# EAGLE design Lattice FPGA standard feather wing (EAGLE 9.5.2)
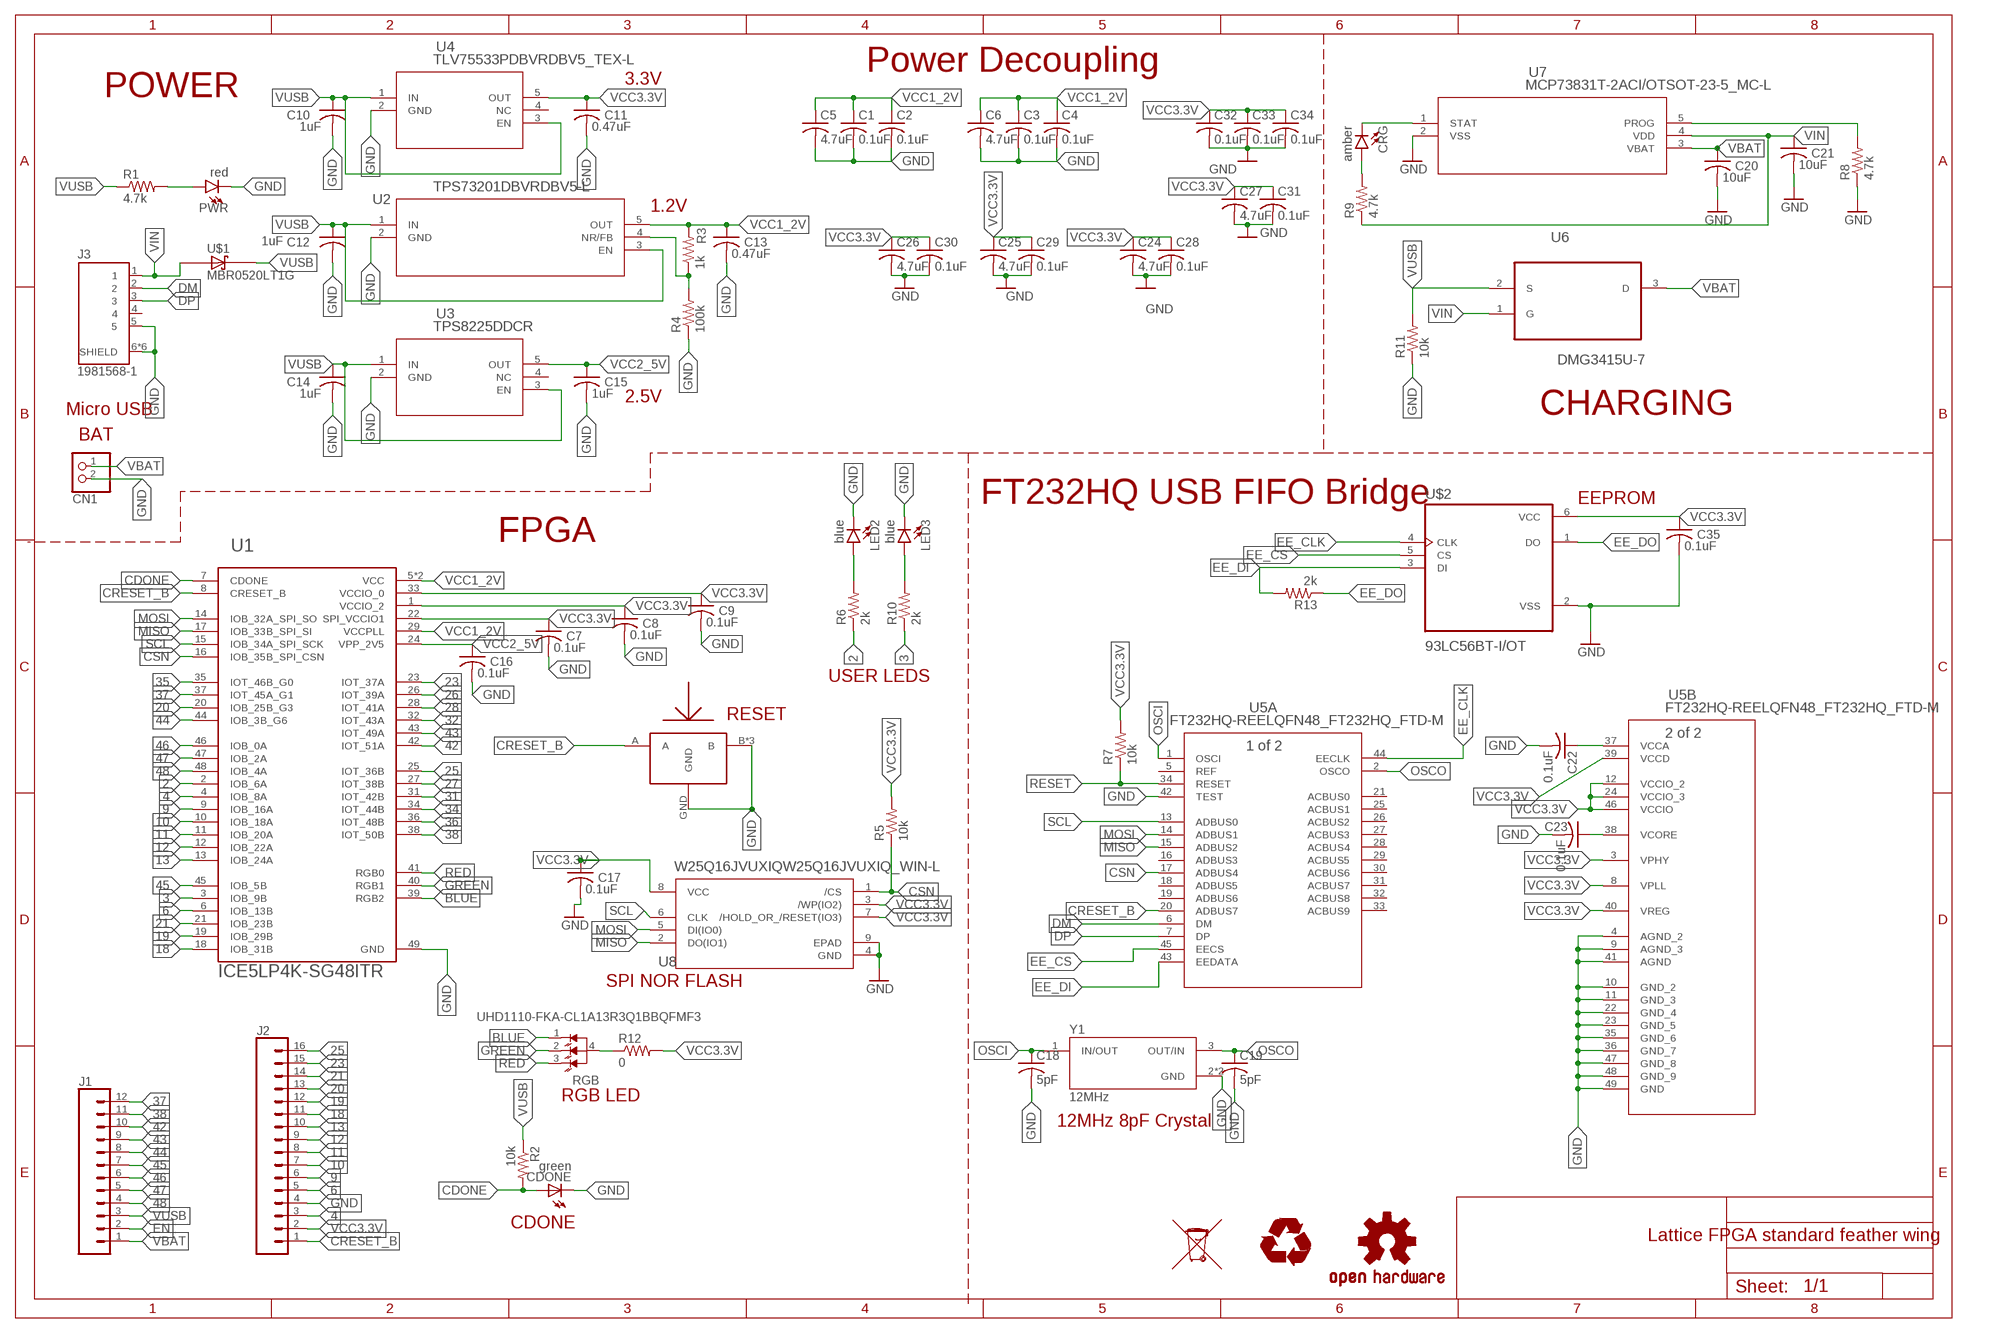
[diagram p0: schematic, sheet 1]

## Parts
C1  0.1uF  C-USC0402  [C0402]
C2  0.1uF  C-USC0402  [C0402]
C3  0.1uF  C-USC0402  [C0402]
C4  0.1uF  C-USC0402  [C0402]
C5  4.7uF  C-USC0603  [C0603]
C6  4.7uF  C-USC0603  [C0603]
C7  0.1uF  C-USC0402  [C0402]
C8  0.1uF  C-USC0402  [C0402]
C9  0.1uF  C-USC0402  [C0402]
C10  1uF  C-USC0402  [C0402]
C11  0.47uF  C-USC0402  [C0402]
C12  1uF  C-USC0402  [C0402]
C13  0.47uF  C-USC0402  [C0402]
C14  1uF  C-USC0402  [C0402]
C15  1uF  C-USC0402  [C0402]
C16  0.1uF  C-USC0402  [C0402]
C17  0.1uF  C-USC0402  [C0402]
C18  5pF  C-USC0402  [C0402]
C19  5pF  C-USC0402  [C0402]
C20  10uF  C-USC0603  [C0603]
C21  10uF  C-USC0603  [C0603]
C22  0.1uF  C-USC0402  [C0402]
C23  0.1uF  C-USC0402  [C0402]
C24  4.7uF  C-USC0603  [C0603]
C25  4.7uF  C-USC0603  [C0603]
C26  4.7uF  C-USC0603  [C0603]
C27  4.7uF  C-USC0603  [C0603]
C28  0.1uF  C-USC0402  [C0402]
C29  0.1uF  C-USC0402  [C0402]
C30  0.1uF  C-USC0402  [C0402]
C31  0.1uF  C-USC0402  [C0402]
C32  0.1uF  C-USC0402  [C0402]
C33  0.1uF  C-USC0402  [C0402]
C34  0.1uF  C-USC0402  [C0402]
C35  0.1uF  C-USC0402  [C0402]
CDONE  green  LEDCHIP-LED0603  [CHIP-LED0603]
CN1  JST_2PIN-SMT-RA  [JST-PH-2-SMT-RA]
CRG  amber  LED0603  [LED-0603]
J1  CONN_12NO_SILK  [1X12_NO_SILK]
J2  CONN_161X16_NO_SILK  [1X16_NO_SILK]
J3  1981568-1  [TE_1981568-1]
LED2  blue  LED0603  [LED-0603]
LED3  blue  LED0603  [LED-0603]
LOGO1  OSHW-LOGOS  [OSHW-LOGO-S]
PWR  red  LED0603  [LED-0603]
R1  4.7k  R-US_R0603  [R0603]
R2  10k  R-US_R0402  [R0402]
R3  1k  R-US_R0402  [R0402]
R4  100k  R-US_R0402  [R0402]
R5  10k  R-US_R0402  [R0402]
R6  2k  R-US_R0402  [R0402]
R7  10k  R-US_R0603  [R0603]
R8  4.7k  R-US_R0603  [R0603]
R9  4.7k  R-US_R0603  [R0603]
R10  2k  R-US_R0402  [R0402]
R11  10k  R-US_R0402  [R0402]
R12  0  R-US_R0603  [R0603]
R13  2k  R-US_R0402  [R0402]
RGB  UHD1110-FKA-CL1A13R3Q1BBQFMF3  [LED_UHD1110-FKA-CL1A13R3Q1BBQFMF3]
U1  ICE5LP4K-SG48ITR  ICE5LP1K-SG48ITR  [QFN50P700X700X100-49N]
U2  TPS73201DBVRDBV5-L  [DBV5-L]
U3  TPS8225DDCR  TLV75533PDBVRDBV5_TEX-L  [DBV5_TEX-L]
U4  TLV75533PDBVRDBV5_TEX-L  [DBV5_TEX-L]
U5  FT232HQ-REELQFN48_FT232HQ_FTD-M  [QFN48_FT232HQ_FTD-M]
U6  DMG3415U-7  [SOT95P240X105-3N]
U7  MCP73831T-2ACI/OTSOT-23-5_MC-L  [SOT-23-5_MC-L]
U8  W25Q16JVUXIQW25Q16JVUXIQ_WIN-L  [W25Q16JVUXIQ_WIN-L]
U$1  MBR0520LT1G  [SOD3716X117(SOD-123)]
U$2  93LC56BT-I/OT  [SOT95P280X145-6N]
U$3  SOF-232HST  [3.3X2.9]
Y1  12MHz  ECS-480-10-37-JTN-TR  [XTAL_ECS-480-10-37-JTN-TR]

## Nets
2: R6.1 U1.2(IOB_6A)
3: R10.1 U1.3(IOB_9B)
4: J2.3 U1.4(IOB_8A)
6: J2.5 U1.6(IOB_13B)
9: J2.6 U1.9(IOB_16A)
10: J2.7 U1.10(IOB_18A)
11: J2.8 U1.11(IOB_20A)
12: J2.9 U1.12(IOB_22A)
13: J2.10 U1.13(IOB_24A)
18: J2.11 U1.18(IOB_31B)
19: J2.12 U1.19(IOB_29B)
20: J2.13 U1.20(IOB_25B_G3)
21: J2.14 U1.21(IOB_23B)
23: J2.15 U1.23(IOT_37A)
25: J2.16 U1.25(IOT_36B)
26: U1.26(IOT_39A)
27: U1.27(IOT_38B)
28: U1.28(IOT_41A)
31: U1.31(IOT_42B)
32: U1.32(IOT_43A)
34: U1.34(IOT_44B)
35: U1.35(IOT_46B_G0)
36: U1.36(IOT_48B)
37: J1.12 U1.37(IOT_45A_G1)
38: J1.11 U1.38(IOT_50B)
42: J1.10 U1.42(IOT_51A)
43: J1.9 U1.43(IOT_49A)
44: J1.8 U1.44(IOB_3B_G6)
45: J1.7 U1.45(IOB_5B)
46: J1.6 U1.46(IOB_0A)
47: J1.5 U1.47(IOB_2A)
48: J1.4 U1.48(IOB_4A)
BLUE: RGB.1(BLUE) U1.39(RGB2)
CDONE: CDONE.A R2.2 U1.7(CDONE)
CRESET_B: J2.1 U1.8(CRESET_B) U5.20(A:ADBUS7) U$3.A
CSN: R5.1 U1.16(IOB_35B_SPI_CSN) U5.17(A:ADBUS4) U8.1(/CS)
DM: J3.2 U5.6(A:DM)
DP: J3.3 U5.7(A:DP)
EE_CLK: U5.44(A:EECLK) U$2.4(CLK)
EE_CS: U5.45(A:EECS) U$2.5(CS)
EE_DI: R13.2 U5.43(A:EEDATA) U$2.3(DI)
EE_DO: R13.1 U$2.1(DO)
EN: J1.2
GND: C1.2 C2.2 C3.2 C4.2 C5.2 C6.2 C7.2 C8.2 C9.2 C10.2 C11.2 C12.2 C13.2 C14.2 C15.2 C16.2 C17.2 C18.2 C19.2 C20.2 C21.2 C22.2 C23.2 C24.2 C25.2 C26.2 C27.2 C28.2 C29.2 C30.2 C31.2 C32.2 C33.2 C34.2 C35.2 CDONE.C CN1.2 J2.4 J3.5 J3.6(SHIELD) J3.7(SHIELD) J3.8(SHIELD) J3.9(SHIELD) J3.10(SHIELD) J3.11(SHIELD) LED2.C LED3.C PWR.C R4.1 R8.1 R11.1 U1.49(GND) U2.2(GND) U3.2(GND) U4.2(GND) U5.4(B:AGND_2) U5.9(B:AGND_3) U5.10(B:GND_2) U5.11(B:GND_3) U5.22(B:GND_4) U5.23(B:GND_5) U5.35(B:GND_6) U5.36(B:GND_7) U5.41(B:AGND) U5.42(A:TEST) U5.47(B:GND_8) U5.48(B:GND_9) U5.49(B:GND) U7.2(VSS) U8.4(GND) U8.9(EPAD) U$2.2(VSS) U$3.B U$3.B2(B) U$3.B3(B) U$3.GND Y1.2(GND) Y1.4(GND)
GREEN: RGB.2(GREEN) U1.40(RGB1)
MISO: U1.17(IOB_33B_SPI_SI) U5.15(A:ADBUS2) U8.2(DO(IO1))
MOSI: U1.14(IOB_32A_SPI_SO) U5.14(A:ADBUS1) U8.5(DI(IO0))
N$1: R3.1 R4.2 U2.4(NR/FB)
N$4: R8.2 U7.5(PROG)
N$5: C23.1 U5.38(B:VCORE)
N$6: CRG.C U7.1(STAT)
N$7: CRG.A R9.2
N$8: R12.1 RGB.4(ANODE)
N$10: PWR.A R1.2
N$11: C22.1 U5.37(B:VCCA)
N$13: LED2.A R6.2
N$14: LED3.A R10.2
OSCI: C18.1 U5.1(A:OSCI) Y1.1(IN/OUT)
OSCO: C19.1 U5.2(A:OSCO) Y1.3(OUT/IN)
RED: RGB.3(RED) U1.41(RGB0)
RESET: R7.1 U5.34(A:RESET)
SCL: U1.15(IOB_34A_SPI_SCK) U5.13(A:ADBUS0) U8.6(CLK)
VBAT: C20.1 CN1.1 J1.1 U6.3(D) U7.3(VBAT)
VCC1_2V: C1.1 C2.1 C3.1 C4.1 C5.1 C6.1 C13.1 R3.2 U1.5(VCC) U1.29(VCCPLL) U1.30(VCC) U2.5(OUT)
VCC2_5V: C15.1 C16.1 U1.24(VPP_2V5) U3.5(OUT)
VCC3.3V: C7.1 C8.1 C9.1 C11.1 C17.1 C24.1 C25.1 C26.1 C27.1 C28.1 C29.1 C30.1 C31.1 C32.1 C33.1 C34.1 C35.1 J2.2 R5.2 R7.2 R12.2 U1.1(VCCIO_2) U1.22(SPI_VCCIO1) U1.33(VCCIO_0) U4.5(OUT) U5.3(B:VPHY) U5.8(B:VPLL) U5.12(B:VCCIO_2) U5.24(B:VCCIO_3) U5.39(B:VCCD) U5.40(B:VREG) U5.46(B:VCCIO) U8.3(/WP(IO2)) U8.7(/HOLD_OR_/RESET(IO3)) U8.8(VCC) U$2.6(VCC)
VIN: C21.1 J3.1 R9.1 U6.1(G) U7.4(VDD) U$1.2(A)
VUSB: C10.1 C12.1 C14.1 J1.3 R1.1 R2.1 R11.2 U2.1(IN) U2.3(EN) U3.1(IN) U3.3(EN) U4.1(IN) U4.3(EN) U6.2(S) U$1.1(C)
Unconnected: J3.4 U3.4(NC) U4.4(NC) U5.5(A:REF) U5.16(A:ADBUS3) U5.18(A:ADBUS5) U5.19(A:ADBUS6) U5.21(A:ACBUS0) U5.25(A:ACBUS1) U5.26(A:ACBUS2) U5.27(A:ACBUS3) U5.28(A:ACBUS4) U5.29(A:ACBUS5) U5.30(A:ACBUS6) U5.31(A:ACBUS7) U5.32(A:ACBUS8) U5.33(A:ACBUS9)

## Notes on the sheet
- Power Decoupling
- 3.3V
- POWER
- 1.2V
- 2.5V
- Micro USB | CHARGING
- BAT
- FT232HQ USB FIFO Bridge | EEPROM
- FPGA
- USER LEDS
- RESET
- SPI NOR FLASH
- RGB LED
- 12MHz 8pF Crystal
- CDONE

## Library data of the parts
C1-C35 = rcl:C-US: CAPACITOR, American symbol; SPICEPREFIX: C
CDONE = adafruit:LED: LED OSRAM: - CHIPLED LG R971, LG N971, LY N971, LG Q971, LY Q971, LO R971, LY R971 LH N974, LH R974 LS Q976, LO Q976, LY Q976 LO Q996 - Hyper CHIPLED LW Q18S LB Q993, LB Q99A, LB R99A - SideLED LS A670, LO A670, LY A670, LG A670, LP A670 LB A673, LV A673, LT A673, LW A673 LH A674 LY A675 LS A676, LA A676, LO A676, LY A676, LW A676 LS A679, LY A679, LG A679 - Hyper Micro SIDELED® LS Y876, LA Y876, LO Y876, LY Y876 LT Y87S - SmartLED LW L88C, LW L88S LB L89C, LB L89S, LG L890 LS L89K, LO L89K, LY L89K LS L896, LA L896, LO L896, LY L896 - TOPLED LS T670, LO T670, LY T670, LG T670, LP T670 LSG T670, LSP T670, LSY T670, LOP T670, LYG T670 LG T671, LOG T671, LSG T671 LB T673, LV T673, LT T673, LW T673 LH T674 LS T676, LA T676, LO T676, LY T676, LB T676, LH T676, LSB T676, LW T676 LB T67C, LV T67C, LT T67C, LS T67K, LO T67K, LY T67K, LW E67C LS E67B, LA E67B, LO E67B, LY E67B, LB E67C, LV E67C, LT E67C LW T67C LS T679, LY T679, LG T679 LS T770, LO T770, LY T770, LG T770, LP T770 LB T773, LV T773, LT T773, LW T773 LH T774 LS E675, LA E675, LY E675, LS T675 LS T776, LA T776, LO T776, LY T776, LB T776 LHGB T686 LT T68C, LB T68C - Hyper Mini TOPLED® LB M676 - Mini TOPLED Santana® LG M470 LS M47K, LO M47K, LY M47K Source: http://www.osram.convergy.de/
CN1 = adafruit:JST_2PIN: JST 2-Pin Connectors of various flavors SMT-RA (S2B-PH-SM4) 4UConnector #17311 SMT (B2B-PH-SM4) THM-RA (S2B-PH) THM (B2B-PH)
CRG LED2 LED3 PWR = SparkFun-LED:LED: LED (Generic) Standard schematic elements and footprints for 5mm, 3mm, 1206, and 0603 sized LEDs. Generic LEDs with no color specified.
J1 = SparkFun-Connectors:CONN_12: Multi connection point. Often used as Generic Header-pin footprint for 0.1 inch spaced/style header connections On any of the 0.1 inch spaced packages, you can populate with these: Break Away Headers - Straight <https://www.sparkfun.com/products/116> (PRT-00116) Break Away Male Headers - Right Angle <https://www.sparkfun.com/products/553> (PRT-00553) Female Headers <https://www.sparkfun.com/products/115> (PRT-00115) Break Away Headers - Machine Pin <https://www.sparkfun.com/products/117> (PRT-00117) Break Away Female Headers - Swiss Machine Pin <https://www.sparkfun.com/products/743> (PRT-00743) For SCREWTERMINALS and SPRING TERMINALS visit here: Screw Terimnals on SparkFun.com <https://www.sparkfun.com/search/results?term=Screw+Terminals> (5mm/3.5mm/2.54mm spacing) This device is also useful as a general connection point to wire up your design to another part of your project. Our various solder wires solder well into these plated through hole pads. Hook-Up Wire - Assortment (Stranded, 22 AWG) <https://www.sparkfun.com/products/11375> (PRT-11375) Hook-Up Wire - Assortment (Solid Core, 22 AWG) <https://www.sparkfun.com/products/11367> (PRT-11367) View the entire wire category on our website here <https://www.sparkfun.com/categories/141> Special notes: Molex polarized connector foot print use with SKU : PRT-08231 with associated crimp pins and housings. 1MM SMD Version SKU: PRT-10208 NOTES ON THE VARIANTS LOCK and LOCK_LONGPADS... This footprint was designed to help hold the alignment of a through-hole component (i.e. 6-pin header) while soldering it into place. You may notice that each hole has been shifted either up or down by 0.005 of an inch from it's more standard position (which is a perfectly straight line). This slight alteration caused the pins (the squares in the middle) to touch the edges of the holes. Because they are alternating, it causes a "brace" to hold the component in place. 0.005 has proven to be the perfect amount of "off-center" position when using our standard breakaway headers. Although looks a little odd when you look at the bare footprint, once you have a header in there, the alteration is very hard to notice. Also,if you push a header all the way into place, it is covered up entirely on the bottom side.
J2 = SparkFun-Connectors:CONN_16: Multi connection point. Often used as Generic Header-pin footprint for 0.1 inch spaced/style header connections On any of the 0.1 inch spaced packages, you can populate with these: Break Away Headers - Straight <https://www.sparkfun.com/products/116> (PRT-00116) Break Away Male Headers - Right Angle <https://www.sparkfun.com/products/553> (PRT-00553) Female Headers <https://www.sparkfun.com/products/115> (PRT-00115) Break Away Headers - Machine Pin <https://www.sparkfun.com/products/117> (PRT-00117) Break Away Female Headers - Swiss Machine Pin <https://www.sparkfun.com/products/743> (PRT-00743) For SCREWTERMINALS and SPRING TERMINALS visit here: Screw Terimnals on SparkFun.com <https://www.sparkfun.com/search/results?term=Screw+Terminals> (5mm/3.5mm/2.54mm spacing) This device is also useful as a general connection point to wire up your design to another part of your project. Our various solder wires solder well into these plated through hole pads. Hook-Up Wire - Assortment (Stranded, 22 AWG) <https://www.sparkfun.com/products/11375> (PRT-11375) Hook-Up Wire - Assortment (Solid Core, 22 AWG) <https://www.sparkfun.com/products/11367> (PRT-11367) View the entire wire category on our website here <https://www.sparkfun.com/categories/141> Special notes: Molex polarized connector foot print use with SKU : PRT-08231 with associated crimp pins and housings. 1MM SMD Version SKU: PRT-10208 NOTES ON THE VARIANTS LOCK and LOCK_LONGPADS... This footprint was designed to help hold the alignment of a through-hole component (i.e. 6-pin header) while soldering it into place. You may notice that each hole has been shifted either up or down by 0.005 of an inch from it's more standard position (which is a perfectly straight line). This slight alteration caused the pins (the squares in the middle) to touch the edges of the holes. Because they are alternating, it causes a "brace" to hold the component in place. 0.005 has proven to be the perfect amount of "off-center" position when using our standard breakaway headers. Although looks a little odd when you look at the bare footprint, once you have a header in there, the alteration is very hard to notice. Also,if you push a header all the way into place, it is covered up entirely on the bottom side.
J3 = 1981568-1:1981568-1: CONN RCPT MICRO USB B R/A SMD; AVAILABILITY: Unavailable; DESCRIPTION: USB - micro B USB 2.0 Receptacle Connector 5 Position Surface Mount, Right Angle; MF: TE Connectivity; MP: 19815681; PACKAGE: None; PRICE: None; TE_PURCHASE_URL: https://www.te.com/usa-en/product-19815681.html?te_bu=Cor&te_type=disp&te_campaign=seda_glo_cor-seda-global-disp-prtnr-fy19-seda-model-bom-cta_sma-317_1&elqCampaignId=32493
LOGO1 = SparkFun-Aesthetics:OSHW-LOGO: Open-Source Hardware (OSHW) Logo This logo indicates the piece of hardware it is found on incorporates a OSHW license and/or adheres to the definition of open source hardware found here: http://freedomdefined.org/OSHW
R1-R13 = rcl:R-US_: RESISTOR, American symbol; SPICEPREFIX: R
RGB = UHD1110-FKA-CL1A13R3Q1BBQFMF3:UHD1110-FKA-CL1A13R3Q1BBQFMF3: LED RGB SMD, SIZE 1 X 1 mm; DESCRIPTION: Red, Green, Blue (RGB) LED Indication - Discrete 1.9V Red, 2.9V Green, 2.9V Blue 0404 (1010 Metric); DIGI-KEY_PART_NUMBER: UHD1110-FKA-CL1A13R3Q1BBQFMF3CT-ND; DIGIKEY-PURCHASE-URL: https://snapeda.com/shop?store=DigiKey&id=2684282; MF: Cree Inc.; MOUSER-PURCHASE-URL: https://snapeda.com/shop?store=Mouser&id=2684282; MP: UHD1110-FKA-CL1A13R3Q1BBQFMF3; PACKAGE: 0404 Cree Inc.
U1 = ICE5LP1K-SG48ITR:ICE5LP1K-SG48ITR: Ic Fpga 1100luts 1.2v 48qfn; DESCRIPTION: IC FPGA 39 I/O 48QFN; DIGI-KEY_PART_NUMBER: 220-2155-1-ND; MF: Lattice Semiconductor; MP: ICE5LP1K-SG48ITR; PACKAGE: QFN-48 Lattice Semiconductor
U2 = TPS73201DBVR:TPS73201DBVR; BUILT_BY: EMA_UL_Team; MANUFACTURER: Texas Instruments; MANUFACTURER_PART_NUMBER: TPS73201DBVR; VENDOR: Texas Instruments
U3 U4 = TLV75533pdbvr:TLV75533PDBVR; COPYRIGHT: Copyright (C) 2018 Accelerated Designs. All rights reserved; MANUFACTURER_PART_NUMBER: TLV75533PDBVR; SOURCELIBRARY: TI_2019-06-18; VENDOR: Texas Instruments
U5 = FTDI_DEVICES:FT232HQ-REEL; BUILT_BY: EMA_Cory; COPYRIGHT: Copyright (C) 2018 Accelerated Designs. All rights reserved; DATASHEET: https://www.ftdichip.com/Support/Documents/DataSheets/ICs/DS_FT232H.pdf; MANUFACTURER_PART_NUMBER: FT232HQ-REEL; SOURCELIBRARY: FTDI_2020-04-10; VENDOR: FTDI
U6 = DMG3415U-7:DMG3415U-7: P-CHANNEL ENHANCEMENT MODE MOSFET; AVAILABILITY: Unavailable; DESCRIPTION: P-Channel 20V 4A _Ta_ 900mW _Ta_ Surface Mount SOT-23-3; MF: Diodes Inc.; MP: DMG3415U-7; PACKAGE: SOT-23-3 Diodes Inc.; PRICE: None
U7 = MCP73831-2ACI:MCP73831T-2ACI/OT; BUILT_BY: EMA_UL_Team; MANUFACTURER_PART_NUMBER: MCP73831T-2ACI/OT; VENDOR: Microchip
U8 = Winbond SPI Flash:W25Q16JVUXIQ; BUILT_BY: EMA_Colton; COPYRIGHT: Copyright (C) 2018 Accelerated Designs. All rights reserved; DATASHEET: https://www.mouser.com/datasheet/2/949/w25n01gw_reve_021318_unsecured-1489855.pdf; MANUFACTURER_PART_NUMBER: W25Q16JVUXIQ; SOURCELIBRARY: Winbond_2020-03-18; VENDOR: Winbond
U$1 = MBR0520LT1G:MBR0520LT1G: Surface Mount Schottky Power Rectifier Plastic SOD−123 Package; AVAILABILITY: Unavailable; DESCRIPTION: Diode Schottky 20V 500mA Surface Mount SOD-123; MF: ON Semiconductor; MP: MBR0520LT1G; PACKAGE: SOD-123 ON Semiconductor; PRICE: None
U$2 = 93LC56BT-I_OT:93LC56BT-I/OT; DESCRIPTION: IC EEPROM 2K SPI 2MHZ SOT23-6; MF: Microchip Technology; MP: 93LC56BT-I/OT; PACKAGE: None; PURCHASE-URL: https://pricing.snapeda.com/search/part/93LC56BT-I/OT/?ref=eda
U$3 = Mitsumi Buttons:SOF-232HST
Y1 = ECS-480-10-37-JTN-TR:ECS-480-10-37-JTN-TR: SMD Crystal 2.0 x 1.6 x 0.45 mm ceramic package; AVAILABILITY: Unavailable; DESCRIPTION: 48MHz ±20ppm Crystal 10pF 50 Ohms 4-SMD, No Lead; MF: ECS Inc.; MP: ECS-480-10-37-JTN-TR; PACKAGE: SMD-4 ECS International; PRICE: None

## Board
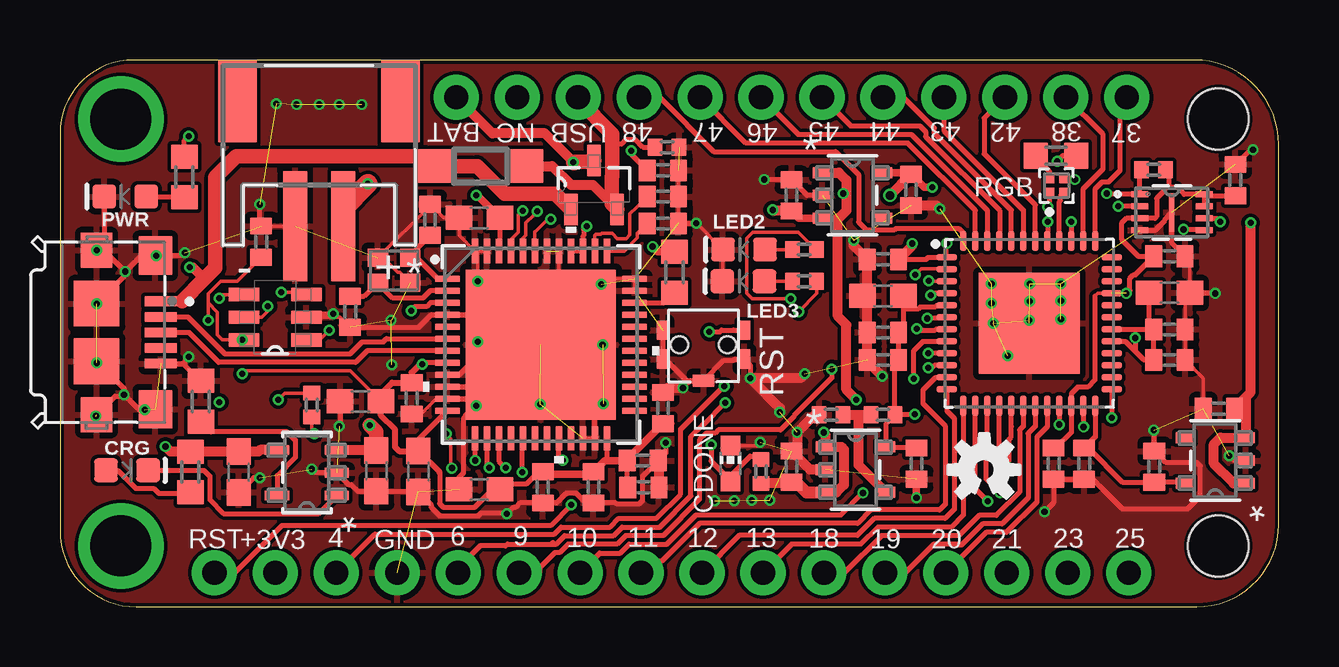
[diagram p1: board, top side]
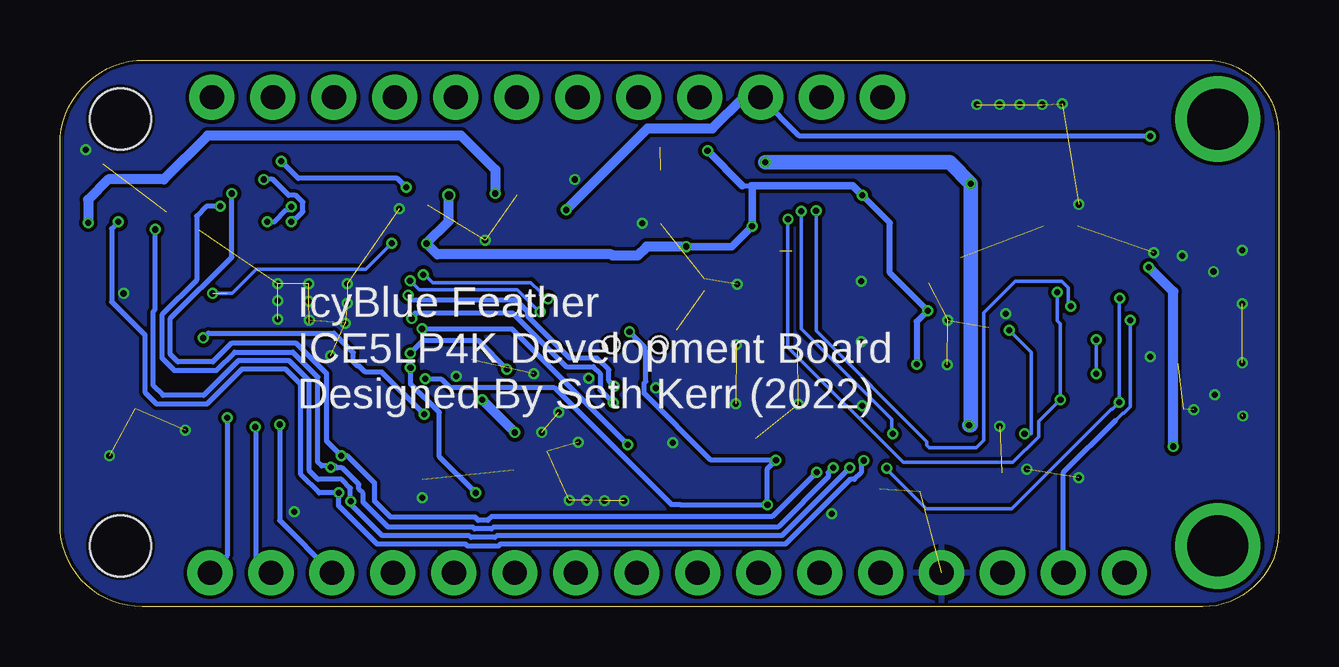
[diagram p2: board, bottom side, seen from below]

Size 50.78 x 22.78 mm. Coordinates in mm from the lower left corner, seen from the top.
Outline: 47.26,22.78 3.06,22.78 arc90 0,19.72 0,3.17 arc90 3.17,0 47.36,0 arc90 50.78,3.42 50.78,19.26 arc90 47.26,22.78
Copper layers (1*16): Top 0.035mm / dielectric 1.5mm / Bottom 0.035mm
Design rules "default *": minimum track width 6mil, minimum drill 10mil, track to track 6mil, track to pad 6mil, pad to pad 6mil, via to via 6mil, smd to smd 6mil, copper to edge 6mil, drill to drill 6mil, minimum pad ring 10mil, minimum via ring 4mil, stop-mask expansion 1mil, vias tented up to drill 30mil, thermal gap 10mil
Holes 2.54 mm at 48.26,2.54 48.26,20.32

### Footprints (pad centres in the part's own frame; a part is rotated, then mirrored left to right if it is on the bottom)
C0402 = smd 0.7 x 0.9: 1 -0.65,0; 2 0.65,0
C0603 = smd 1.1 x 1: 1 -0.85,0; 2 0.85,0
CHIP-LED0603 = smd 0.8 x 0.8: A 0,-0.75; C 0,0.75
JST-PH-2-SMT-RA = smd 1 x 4.6: 1 1,-3.7; 2 -1,-3.7 | smd 1.6 x 3.4: NC1 -3.4,1.5; NC2 3.4,1.5
LED-0603 = smd 1 x 1: A -0.877,0; C 0.877,0
1X12_NO_SILK = drill 1.016 pad 1.88: 1 0,0; 2 2.54,0; 3 5.08,0; 4 7.62,0; 5 10.16,0; 6 12.7,0; 7 15.24,0; 8 17.78,0; 9 20.32,0; 10 22.86,0; 11 25.4,0; 12 27.94,0
1X16_NO_SILK = drill 1.016 pad 1.88: 1 0,0; 2 2.54,0; 3 5.08,0; 4 7.62,0; 5 10.16,0; 6 12.7,0; 7 15.24,0; 8 17.78,0; 9 20.32,0; 10 22.86,0; 11 25.4,0; 12 27.94,0; 13 30.48,0; 14 33.02,0; 15 35.56,0; 16 38.1,0
TE_1981568-1 = smd 0.4 x 1.35: 1 -1.3,2.675; 2 -0.65,2.675; 3 0,2.675; 4 0.65,2.675; 5 1.3,2.675 | smd 1.6 x 1.4: 6 -3.2,2.45; 7 3.2,2.45 | smd 1.45 x 1.3: 8 3.425,0; 9 -3.425,0 | smd 1.9 x 1.9: 10 -1.2,0; 11 1.2,0
R0603 = smd 1 x 1.1: 1 -0.85,0; 2 0.85,0
R0402 = smd 0.6 x 0.7: 1 -0.5,0; 2 0.5,0
LED_UHD1110-FKA-CL1A13R3Q1BBQFMF3 = smd 0.4 x 0.4: 1 -0.3,0.3; 2 -0.3,-0.3; 3 0.3,-0.3; 4 0.3,0.3
QFN50P700X700X100-49N = smd 0.84 x 0.26: 1 -3.435,2.75; 2 -3.435,2.25; 3 -3.435,1.75; 4 -3.435,1.25; 5 -3.435,0.75; 6 -3.435,0.25; 7 -3.435,-0.25; 8 -3.435,-0.75; 9 -3.435,-1.25; 10 -3.435,-1.75; 11 -3.435,-2.25; 12 -3.435,-2.75; 25 3.435,-2.75; 26 3.435,-2.25; 27 3.435,-1.75; 28 3.435,-1.25; 29 3.435,-0.75; 30 3.435,-0.25; 31 3.435,0.25; 32 3.435,0.75; 33 3.435,1.25; 34 3.435,1.75; 35 3.435,2.25; 36 3.435,2.75 | smd 0.26 x 0.84: 13 -2.75,-3.435; 14 -2.25,-3.435; 15 -1.75,-3.435; 16 -1.25,-3.435; 17 -0.75,-3.435; 18 -0.25,-3.435; 19 0.25,-3.435; 20 0.75,-3.435; 21 1.25,-3.435; 22 1.75,-3.435; 23 2.25,-3.435; 24 2.75,-3.435; 37 2.75,3.435; 38 2.25,3.435; 39 1.75,3.435; 40 1.25,3.435; 41 0.75,3.435; 42 0.25,3.435; 43 -0.25,3.435; 44 -0.75,3.435; 45 -1.25,3.435; 46 -1.75,3.435; 47 -2.25,3.435; 48 -2.75,3.435 | smd 4.2 x 4.2: 49 0,0
DBV5-L = smd 0.775 x 0.457: 1 -1.264,0.95; 2 -1.264,0; 3 -1.264,-0.95; 4 1.264,-0.95; 5 1.264,0.95
DBV5_TEX-L = smd 0.775 x 0.457: 1 -1.264,0.95; 2 -1.264,0; 3 -1.264,-0.95; 4 1.264,-0.95; 5 1.264,0.95
QFN48_FT232HQ_FTD-M = smd 1.016 x 0.254: 1 -3.899,2.75; 2 -3.899,2.25; 3 -3.899,1.75; 4 -3.899,1.25; 5 -3.899,0.75; 6 -3.899,0.25; 7 -3.899,-0.25; 8 -3.899,-0.75; 9 -3.899,-1.25; 10 -3.899,-1.75; 11 -3.899,-2.25; 12 -3.899,-2.75; 25 3.899,-2.75; 26 3.899,-2.25; 27 3.899,-1.75; 28 3.899,-1.25; 29 3.899,-0.75; 30 3.899,-0.25; 31 3.899,0.25; 32 3.899,0.75; 33 3.899,1.25; 34 3.899,1.75; 35 3.899,2.25; 36 3.899,2.75 | smd 0.254 x 1.016: 13 -2.75,-3.899; 14 -2.25,-3.899; 15 -1.75,-3.899; 16 -1.25,-3.899; 17 -0.75,-3.899; 18 -0.25,-3.899; 19 0.25,-3.899; 20 0.75,-3.899; 21 1.25,-3.899; 22 1.75,-3.899; 23 2.25,-3.899; 24 2.75,-3.899; 37 2.75,3.899; 38 2.25,3.899; 39 1.75,3.899; 40 1.25,3.899; 41 0.75,3.899; 42 0.25,3.899; 43 -0.25,3.899; 44 -0.75,3.899; 45 -1.25,3.899; 46 -1.75,3.899; 47 -2.25,3.899; 48 -2.75,3.899 | smd 6.248 x 6.248: 49 0,0
SOT95P240X105-3N = smd 1.321 x 0.559: 1 -1.016,0.965; 2 -1.016,-0.965; 3 1.016,0
SOT-23-5_MC-L = smd 1.016 x 0.406: 1 -1.245,0.95; 2 -1.245,0; 3 -1.245,-0.95; 4 1.245,-0.95; 5 1.245,0.95
W25Q16JVUXIQ_WIN-L = smd 0.711 x 0.254: 1 -1.348,0.75; 2 -1.348,0.25; 3 -1.348,-0.25; 4 -1.348,-0.75; 5 1.348,-0.75; 6 1.348,-0.25; 7 1.348,0.25; 8 1.348,0.75 | smd 0.203 x 1.6: 9 0,0
SOD3716X117(SOD-123) = smd 1.4 x 1.4: 1 -1.9,0.051; 2 1.9,0.051
SOT95P280X145-6N = smd 1.27 x 0.559: 1 -1.295,0.94; 2 -1.295,0; 3 -1.295,-0.94; 4 1.295,-0.94; 5 1.295,0; 6 1.295,0.94
3.3X2.9 = smd 0.5 x 0.8: A -0.7,-0.6; B2 2.7,0.6; B3 2.7,-0.6; GND -0.7,0.6 | smd 0.9 x 0.5: B 1,1.5 | hole 0.7: 0,0; 2,0
XTAL_ECS-480-10-37-JTN-TR = smd 0.85 x 0.75: 1 -0.675,-0.525; 2 0.675,-0.525; 3 0.675,0.525; 4 -0.675,0.525

### Placement (x,y rotation side)
C1  46.23,11.56 0 top
C2  34.29,11.43 180 top
C3  34.29,10.29 180 top
C4  46.23,10.29 0 top
C5  34.29,12.95 180 top
C6  46.23,13.08 0 top
C7  34.29,14.48 180 top
C8  41.4,5.97 270 top
C9  46.23,14.61 0 top
C10  30.48,17.14 90 top
C11  35.46,17.37 270 top
C12  30.48,5.84 90 top
C13  35.69,5.97 270 top
C14  48.29,8.26 180 top
C15  45.59,5.84 90 top
C16  42.67,5.97 270 top
C17  48.97,17.78 90 top
C18  15.42,16.13 90 top
C19  12.09,12.29 270 top
C20  13.18,5.66 270 top
C21  7.44,5.61 270 top
C22  25.12,15.98 0 top
C23  25.12,17.09 0 top
C24  17.48,4.9 180 top
C25  12.52,8.56 180 top
C26  17.48,16.21 180 top
C27  14.94,5.64 270 top
C28  25.12,18.19 0 top
C29  22.23,4.98 270 top
C30  20.12,4.98 270 top
C31  24.31,4.98 0 top
C32  25.12,8.28 90 top
C33  24.28,6.1 0 top
C34  14.66,8.69 270 top
C35  8.38,15.21 90 top
CDONE  27.94,5.97 0 top
CN1  10.79,19.56 0 top
CRG  2.79,5.69 0 top
J1  16.51,21.23 0 top
J2  6.43,1.42 0 top
J3  1.52,11.43 270 top
LED2  28.5,14.88 180 top
LED3  28.47,13.56 180 top
LOGO1  38.51,5.71 0 top
PWR  2.72,17.09 180 top
R1  5.18,17.91 270 top
R2  29.21,5.64 90 top
R3  34.29,8 0 top
R4  32.13,8 0 top
R5  45.57,18.21 0 top
R6  31.01,14.88 180 top
R7  25.6,13.94 90 top
R8  5.87,8.56 270 top
R9  5.44,5.61 270 top
R10  31.01,13.56 180 top
R11  25.3,19.15 180 top
R12  41.5,18.8 0 top
R13  10.49,8.41 90 top
RGB  41.53,17.55 90 top
U1  40.39,11.81 0 top
U2  33.15,5.71 0 top
U3  48.13,6.1 180 top
U4  33.02,17.14 0 top
U5  20.04,10.92 0 top
U6  22.25,17.58 90 top
U7  10.29,5.59 180 top
U8  46.33,16.43 0 top
U$1  17.53,18.41 180 top
U$2  8.97,12.06 180 top
U$3  27.81,10.92 180 top
Y1  13.92,14.02 180 top

### Tracks (layer width: path | path; a pad name or v marks a point on that pad's centre or on a via)
2  (via drill 0.25)
  Top 0.152: U1.2 36.93,14.09 35.88,14.09 v35.64,13.84 | R6.1 31.49,14.88 30.76,15.61 28.87,15.61 28.62,15.37 28.62,13.06 28.85,12.83 v30.45,12.83
  Bottom 0.152: v35.64,13.84 35.59,13.84 35.26,13.51 31.16,13.51 30.78,13.13 30.78,12.98 30.62,12.83 v30.45,12.83
3  (via drill 0.25)
  Top 0.152: R10.1 31.54,13.54 31.54,13.06 v30.78,12.3 | U1.3 36.22,13.56 v36.2,13.59
  Bottom 0.152: v30.78,12.3 30.82,12.3 31.72,13.21 35.81,13.21 v36.2,13.59
4  (via drill 0.25)
  Top 0.203: U1.4 36.36,13.06 v36.28,12.98 | J2.3 13.12,3.03 20.59,3.03 20.88,3.33 22.92,3.33 23.27,3.68 24.84,3.68 25.86,4.7 25.86,7.4 27.65,9.19 v27.68,9.19
  Bottom 0.203: v36.28,12.98 36.1,12.8 31.78,12.8 31.28,12.3 31.28,12.1 29.55,10.36 28.41,10.36 27.91,9.87 27.91,9.42 v27.68,9.19
6  (via drill 0.25)
  Top 0.203: U1.6 36.9,12.01 v36.13,12.01 | J2.5 16.59,1.63 17.5,2.54 18.56,2.54 18.64,2.61 20.48,2.61 | 20.54,2.68 20.48,2.61 | 20.48,2.61 20.67,2.61 21.03,2.97 23.07,2.97 23.42,3.33 24.99,3.33 26.29,4.62 26.29,7.1 26.78,7.59 26.82,7.59 v27.72,8.49
  Bottom 0.203: v27.72,8.49 28.27,9.04 28.27,9.72 28.55,10.01 29.7,10.01 31.93,12.24 35.99,12.24 35.99,12.15 v36.13,12.01
9  (via drill 0.25)
  Top 0.203: U1.9 v36.18,10.57 | v32.16,9.91 32.16,9.54 30.58,7.96 30.58,7.93 30.03,7.37 27.43,7.37 27.3,7.24 26.93,7.24 26.64,6.96 26.64,4.48 25.14,2.97 23.57,2.97 23.21,2.61 21.18,2.61 20.82,2.26 20.62,2.26 19.98,1.62 19.98,1.42 J2.6
  Bottom 0.203: v36.18,10.57 35.64,11.1 33.35,11.1 v32.16,9.91
10  (via drill 0.25)
  Top 0.203: v33.46,4.74 32.55,3.83 26.51,3.83 25.29,2.61 23.72,2.61 23.34,2.23 22.48,2.23 J2.7 | U1.10 36.43,10.06 36.33,9.96 v36.18,9.96
  Bottom 0.203: v36.18,9.96 36.18,9.3 34.98,8.1 34.98,6.26 v33.46,4.74
11
  Top 0.203: J2.8 24.69,1.9 25.08,1.9 26.66,3.48 33.23,3.48 33.79,4.04 36.65,4.04 36.91,4.29 36.91,7.52 35.97,8.46 35.97,9.04 36.48,9.56 U1.11
12
  Top 0.203: U1.12 36.95,8.16 37.26,7.85 37.26,4.06 36.88,3.68 33.94,3.68 33.23,2.97 28.3,2.97 J2.9
13
  Top 0.203: U1.13 37.64,3.83 37.13,3.33 34.08,3.33 33.37,2.61 30.48,2.61 J2.10
18
  Top 0.203: U1.18 40.14,7.52 39.99,7.37 39.99,5.5 39.98,5.5 39.98,4.78 39.01,3.81 38.29,3.81 37.45,2.97 34.23,2.97 32.68,1.42 J2.11
19
  Top 0.203: U1.19 40.64,7.51 40.34,7.22 40.34,4.54 39.26,3.45 38.44,3.45 37.56,2.57 37.45,2.57 37.4,2.61 36.42,2.61 35.22,1.42 J2.12
20
  Top 0.203: U1.20 41.14,7.51 40.7,7.07 40.7,4.36 39.43,3.1 38.59,3.1 J2.13
21  (via drill 0.25)
  Top 0.203: U1.21 v41.63,7.59
  Bottom 0.203: v41.63,7.59 41.63,3.6 J2.14
23  (via drill 0.25)
  Top 0.203: U1.23 42.64,7.5 v42.65,7.49
  Bottom 0.203: v42.65,7.49 42.62,7.47 42.62,2.05 J2.15
25  (via drill 0.25)
  Top 0.203: U1.25 v43.81,7.87
  Bottom 0.203: v43.81,7.87 43.81,2.13 J2.16
37
  Top 0.203: J1.12 44.19,20.96 44.17,20.95 44.17,18.19 43.69,17.7 43.42,17.7 43.14,17.42 U1.37
38
  Top 0.203: U1.38 42.64,17.42 43.46,18.25 43.46,19.68 J1.11
42
  Top 0.203: U1.42 40.64,16.74 38.51,18.87 38.51,20.37 J1.10
43
  Top 0.203: U1.43 40.14,16.53 36.83,19.84 J1.9
44
  Top 0.203: U1.44 39.64,16.53 36.43,19.74 36.43,19.94 35.14,21.23 J1.8
45
  Top 0.203: J1.7 32.94,20.04 35.83,20.04 36.07,19.8 36.07,19.59 39.15,16.52 U1.45
46
  Top 0.203: J1.6 30.76,19.68 35.48,19.68 38.64,16.52 U1.46
47
  Top 0.203: U1.47 38.14,16.52 35.33,19.32 28.57,19.32 J1.5
48
  Top 0.203: J1.4 24.98,21.23 27.24,18.97 32.31,18.97 33.27,18.01 33.27,16.03 33.59,15.71 34.78,15.71 34.84,15.77 37.44,15.77 37.64,15.58 U1.48
BLUE  (via drill 0.25)
  Top 0.203: RGB.1 41.23,16.74 v41.15,16.66 | v42.14,16.05 U1.39
  Bottom 0.203: v41.15,16.66 41.27,16.54 41.35,16.54 41.83,16.05 v42.14,16.05
CDONE  (via drill 0.25)
  Top 0.203: U1.7 36.49,11.56 36.44,11.51 35.92,11.51 35.85,11.58 v35.7,11.58 | CDONE.A 27.94,5.26 | 27.94,5.26 27.94,5.46 28.75,6.28 29.07,6.28 R2.2 | 27.94,5.26 27.13,6.07 v27.13,6.76
  Bottom 0.203: v35.7,11.58 31.95,11.58 v27.13,6.76
CRESET_B  (via drill 0.25)
  Top 0.203: U1.8 35.96,11.06 35.57,10.67 v35.57,9.5 | J2.1 7.28,1.42 9.25,3.39 20.44,3.39 v21.3,4.25 | v20.95,6.11 20.79,6.27 U5.20 | v27.05,11.46 27.49,11.46 27.56,11.53 28.06,11.53 28.07,11.52 U$3.A
  Bottom 0.203: v35.57,9.5 34.9,9.5 34.52,9.12 30.17,9.12 25.32,4.27 24.95,4.27 24.93,4.25 v21.3,4.25 21.3,5.76 v20.95,6.11 23.66,6.11 26.44,8.89 26.44,9.32 26.36,9.39 26.36,10.62 26.42,10.67 26.42,10.82 v27.05,11.46
CSN  (via drill 0.25)
  Top 0.203: v39.07,6.3 39.14,6.37 U1.16 | v19.25,5.61 19.25,6.99 U5.17 | v43.62,17.22 44.95,17.22 U8.1 44.98,18.13 R5.1
  Bottom 0.203: v19.25,5.61 21.11,3.76 32.8,3.76 32.95,3.6 33.35,3.6 33.49,3.73 37.01,3.73 37.67,4.39 37.67,5.15 38.81,6.3 v39.07,6.3 39.67,6.91 39.67,9.71 40.94,10.97 43.65,10.97 44.41,10.21 45.87,10.21 46.18,10.52 46.18,12.01 43.62,14.57 v43.62,17.22
DM
  Top 0.203: J3.2 5.33,12.08 6.87,10.54 12.09,10.54 12.59,11.04 13.47,11.04 13.6,11.17 U5.6
DP
  Top 0.203: J3.3 5.37,11.43 6.61,10.19 12.32,10.19 12.81,10.67 U5.7
EE_CLK  (via drill 0.25)
  Top 0.152: v6.63,12.85 6.78,13.01 U$2.4 | U5.44 19.29,15.37 19.41,15.48 19.41,15.99 19.74,16.32 19.74,16.33 v19.89,16.48 | v16.33,5.78 16.28,5.83 16.28,7.01 v16.08,7.21
  Bottom 0.152: v6.63,12.85 6.64,12.84 v6.64,8.52 6.94,8.23 6.99,8.23 11.13,4.09 14.68,4.09 16.33,5.74 v16.33,5.78 | v19.89,16.48 19.89,11.58 16.12,7.81 16.12,7.24 v16.08,7.21
EE_CS  (via drill 0.25)
  Top 0.152: v8.66,12.52 8.66,12.32 8.41,12.06 U$2.5 | U5.45 18.79,15.3 19.1,15.61 19.1,16.34 v19.28,16.51
  Bottom 0.152: v19.28,16.51 19.28,11.51 14.66,6.88 14.66,6.73 14.55,6.63 12.6,6.63 12.29,6.93 12.29,12.24 10.97,13.56 9.03,13.56 8.76,13.3 8.76,12.62 v8.66,12.52
EE_DI  (via drill 0.25)
  Top 0.152: v9.22,13.11 10.16,13.11 U$2.3 | U5.43 19.79,15.62 | 19.79,15.62 | 19.79,15.62 20.33,16.15 v20.45,16.15 | v9.09,8.64 9.37,8.91 R13.2
  Bottom 0.152: v9.22,13.11 9.22,11.91 9.09,11.79 v9.09,8.64 10.01,7.72 10.01,7.09 11.07,6.02 15.64,6.02 20.45,10.82 v20.45,16.15
EE_DO  (via drill 0.25)
  Top 0.152: R13.1 10.49,7.32 v10.59,7.21 | v11.23,11.53 10.82,11.12 U$2.1
  Bottom 0.152: v10.59,7.21 10.31,7.21 10.31,10.62 v11.23,11.53
GND  (via drill 0.25)  (54 unrouted)
  Top 0.152: U5.22 U5.23 | U$2.2 11.67,12.06 C19.2 | C35.2 CN1.2 | C28.2 25.77,17.12 C22.2 | U5.36 | U5.36 U5.35 | U5.41 20.79,11.67 U5.49 22.78,13.66 U5.36 | U5.11 15.69,8.68 15.05,8.04 C34.2 | Y1.4 14.15,13.94 14.07,13.94 13.47,14.55 Y1.2 15.42,16.72 C18.2 15.99,16.2 C26.2 16.62,15.49 U5.48 | U5.47 U5.48 | U5.48 17.4,14.71 v17.4,13.56 | CDONE.C 29.05,6.72 v29.18,6.86 | C6.2 47.19,13.08 | C9.2 47.08,14.4 C6.2 | C6.2 46.88,12.88 C1.2 C4.2 47.63,9.53 C14.2 | LED3.C 27.62,13.59 LED2.C v26.53,15.98 v26.52,15.98
  Top 0.203: U4.2 31.13,17.14 C10.2 29.35,17.8 v29.34,17.8 | v41.02,3.96 41.4,4.34 C8.2 C16.2 43.02,5.32 44.26,4.08 46.98,4.08 47.51,4.61 47.51,5.86 47.36,6.01 46.08,6.01 C15.2 45.59,7.34 v45.57,7.37 | U3.2 48.92,6.1 v48.72,6.3 | 47.19,13.08 48.11,13.08 v48.13,13.06 | PWR.C 1.84,15.17 J3.9 1.83,14.86 v2.72,13.97 | C35.2 8.33,15.91 v8.33,16.76 | J3.10 2.72,13.82 v2.72,13.97 | v5.21,14.76 5.08,14.63 v4.01,14.63 J3.6 | J3.6 3.38,14.63 v2.72,13.97 | J3.11 2.67,9.09 v2.67,8.84 2.73,8.78 | J3.5 5.08,10.13 5.14,10.13 5.23,10.05 | 5.23,10.05 R8.1 | 5.23,10.05 5.23,10.28 v5.36,10.41 | J3.7 3.28,8.23 2.73,8.78 | J3.8 2.29,8.78 2.73,8.78 | C21.2 8.06,5.38 v8.33,5.38 | C24.2 16.62,5.39 16.82,5.58 16.82,7.85 16.9,7.94 16.9,7.99 17.25,8.33 | U5.11 16.91,8.67 17.25,8.33 | 17.25,8.33 17.27,8.31 v17.35,8.38 17.5,8.38 17.96,8.84 | U5.9 16.64,9.68 17.4,10.44 v17.4,11.05 | C22.2 v26.52,15.98 | 18.66,3.92 18.9,4.15 18.98,4.15 19.16,4.33 C30.2 20.7,4.33 21.1,4.73 21.5,4.73 21.91,4.33 C29.2 23.15,4.33 23.2,4.27 24.11,4.27 24.26,4.42 24.26,5.42 C33.2 25.25,6.41 v25.25,6.83 | 18.66,3.92 v18.62,3.87 | U5.23 22.29,8.12 v22.63,8.46 | v17.4,11.05 17.4,12.04 17.27,12.17 U5.4 15.47,12.17 14.95,11.64 C19.2 | v10.49,5.74 10.64,5.59 U7.2 12.02,5.09 12.14,5.09 12.43,4.81 C20.2 13.21,4.79 C27.2 15.47,4.26 15.47,4.15 15.82,3.79 17.43,3.79 17.55,3.92 18.66,3.92 | C25.2 11.67,7.56 v11.63,7.52 | U$2.2 10.41,12.22 v11.38,12.22 | U5.10 17.62,9.17 17.96,8.84 | J3.6 | 17.96,8.84 U5.49 17.53,10.92 v17.4,11.05 | U8.4 45.62,15.68 46.05,16.11 46.05,16.15 U8.9 46.33,15.15 C9.2 | C17.2 49.59,19.05 v49.71,19.05 | v28.75,9.53 28.75,10.08 U$3.GND 28.12,10.32 28.06,10.27 27.66,10.27 U$3.B 26.26,9.42 26.19,9.35
  Top 0.203: v25.96,9.12 26.19,9.35 | 26.19,9.35 25.21,10.32 U$3.B2 U$3.B3
  Top 0.305: C13.2 v35.69,4.55
  Top 0.406: U2.2 31.26,5.71 31.08,5.9 31.07,5.9 C12.2 30.71,6.72 v30.71,7.26 31.45,8 R4.1 | v34.27,9.6 33.64,10.23 C3.2 C2.2 33.64,12.75 C5.2 33.64,13.15 C7.2 33.07,15.05 v33.07,15.27 | C11.2 36.52,16.72 v36.65,16.59 | C33.2 24.96,6.07 C31.2 | C32.2 25.31,9.12 v25.96,9.12 | C23.2 25.77,17.12 | v30,8.1 30,8.28 v28.75,9.53 30.86,9.53 v31.04,9.7
  other vias: 20.02,8.43 22.61,10.92 22.56,13.44 41.71,11.99 40.39,11.94 38.89,11.81 38.81,13.46 40.41,13.46 41.71,13.46 27.28,4.42 28.09,4.42 28.83,4.45 29.57,4.45 39.5,10.46 38.81,12.65 40.41,12.73 41.71,12.75 13.82,10.08 9.02,20.95 9.86,20.93 10.79,20.93 11.63,20.93 12.57,20.93 13.79,11.94 3.53,8.2 1.5,7.95 1.52,10.16 1.52,12.62 1.52,14.86
  pour Bottom: -2.54,24.13 52.07,24.13 52.07,-1.27 -1.27,-1.27 -2.54,0
  pour Top: -3.17,26.04 53.34,26.04 53.34,-2.54 -3.17,-2.54
GREEN
  Top 0.203: U1.40 41.64,16.87 41.68,16.92 41.68,17.11 RGB.2
MISO  (via drill 0.25)
  Top 0.203: U5.15 18.29,6.07 v18.57,5.79 | U8.2 v44.1,16.68 v44.1,16.69 | v39.5,5.82 39.5,6.05 39.55,6.1 39.55,6.99 39.63,7.07 39.63,7.52 39.64,7.52 U1.17
  Bottom 0.203: v18.57,5.79 18.77,5.59 18.77,5.41 20.86,3.33 32.73,3.33 32.81,3.25 33.5,3.25 33.58,3.33 37.11,3.33 38.15,4.37 38.15,4.72 38.33,4.9 38.33,5.1 39.02,5.79 39.25,5.79 39.32,5.87 39.52,5.87 | 39.52,5.87 39.88,5.87 40.03,6.02 40.03,9.57 41.08,10.62 43.5,10.62 44.26,9.86 46.02,9.86 46.53,10.37 46.53,12.16 45.09,13.61 45.09,16.28 44.68,16.69 v44.1,16.69 | v39.5,5.82 39.52,5.84 39.52,5.87
MOSI  (via drill 0.25)
  Top 0.203: U5.14 17.79,5.88 v17.88,5.79 | v46.81,15.72 47.64,15.72 U8.5 | v38.66,4.39 38.14,4.92 U1.14
  Bottom 0.203: 38.68,4.39 38.68,4.29 37.36,2.97 33.73,2.97 33.65,2.89 32.66,2.89 32.58,2.97 20.7,2.97 v17.88,5.79 | 38.68,4.39 38.68,4.95 39.04,5.31 40.03,5.31 40.39,5.66 40.39,9.42 41.23,10.26 43.35,10.26 44.8,8.81 46.48,8.81 46.89,9.22 46.89,12.31 46.81,12.38 v46.81,15.72 46.84,15.75 | v38.66,4.39 38.68,4.39
N$1
  Top 0.406: R4.2 33.27,8 | 33.27,8 R3.1 | U2.4 33.27,5.9 33.27,8
N$2  (via drill 2.54)
  other vias: 2.54,2.54
N$3  (via drill 2.54)
  other vias: 2.54,20.32
N$4
  Top 0.203: U7.5 9.04,5.47 9.8,6.23 9.8,6.95 9.46,7.29 6.29,7.29 R8.2 5.68,7.52
N$5
  Top 0.152: C23.1 24.03,16.66 23.75,16.38 23.75,15.5 23.59,15.34 23.23,15.34 23.01,15.56 22.57,15.56 22.53,15.52 22.33,15.52 22.29,15.48 U5.38
N$6
  Top 0.203: CRG.C 6,5.69 6.24,5.45 6.24,4.45 6.81,3.89 10.78,3.89 U7.1
N$7
  Top 0.203: CRG.A 2.4,5.69 3.15,4.94 3.9,4.94 4.12,4.72 5.4,4.72 R9.2
N$8
  Top 0.203: R12.1 40.65,18.72 41.23,18.14 RGB.4
N$10
  Top 0.203: PWR.A 5.14,17.09 R1.2
N$11
  Top 0.152: C22.1 24.05,15.56 24.05,15.38 23.5,14.82 U5.37
N$13
  Top 0.152: LED2.A R6.2
N$14
  Top 0.152: LED3.A R10.2
OSCI
  Top 0.203: 14.67,14.54 14.65,14.53 | C18.1 14.59,14.65 Y1.1 14.61,14.53 14.65,14.53 | U5.1 15.73,13.67 14.88,14.53 14.65,14.53
OSCO
  Top 0.203: U5.2 15.43,13.17 15.12,12.87 13.87,12.87 13.27,13.47 | 13.27,13.47 Y1.3 | C19.1 12.68,12.94 13.2,13.47 13.27,13.47
RED  (via drill 0.25)
  Top 0.203: v41.15,16.05 U1.41 | v42.29,17.8 41.88,17.8 RGB.3
  Bottom 0.203: v41.15,16.05 41.02,16.18 40.95,16.18 40.66,16.46 40.66,16.86 40.95,17.14 41.25,17.14 41.91,17.8 v42.29,17.8
RESET
  Top 0.203: U5.34 25.18,12.67 R7.1
SCL  (via drill 0.25)
  Top 0.203: U5.13 v17.29,6.1 v17.3,6.1 | U1.15 38.64,6.55 38.58,6.5 38.58,5.33 v39.17,4.75 | U8.6 48.2,16.18 v48.35,16.04
  Bottom 0.203: v17.3,6.1 17.4,5.99 17.4,5.59 17.68,5.31 17.86,5.31 20.56,2.61 32.43,2.61 32.51,2.53 33.8,2.53 33.88,2.61 37.56,2.61 39.17,4.22 v39.17,4.75 39.98,4.75 40.74,5.51 40.74,9.27 41.38,9.91 43.2,9.91 44.65,8.46 46.76,8.46 47.24,8.94 47.24,11.33 48.62,12.71 48.62,15.76 v48.35,16.04
VBAT  (via drill 0.25)
  Top 0.203: 11.55,6.51 U7.3
  Top 0.406: C20.1 11.55,6.51 | J1.1 18.02,19.73 20.2,19.73 21.39,18.54 v21.39,18.52
  Top 0.61: C20.1 13.18,7.29 12.95,7.52 | 12.95,7.52 | 12.95,7.52 v12.9,7.57 | 21.41,18.49 v21.39,18.52 21.41,18.54 22.2,18.54 U6.3 | 11.79,16.6 CN1.1
  Top 0.813: v12.83,17.63 11.79,16.6
  Bottom 0.61: v21.39,18.52 13.72,18.52 v12.83,17.63 12.83,7.57 v12.9,7.57
VCC1_2V  (via drill 0.25)
  Top 0.203: R3.2 34.41,7.62 U2.5 34.46,6.62 C13.1 | v35.61,8.03 35.59,8 R3.2 | C5.1 35.14,12.41 | 35.14,12.41 35.14,11.63 C2.1 C3.1 34.79,10.14 R3.2 | U1.5 36.55,12.56 36.47,12.48 35.83,12.48 35.76,12.41 35.14,12.41 | C1.1 C4.1 45.16,10.29 44.81,10.64 | C1.1 45.38,11.76 C6.1 | U1.30 C1.1 | U1.29 44.39,11.06 44.81,10.64 | v44.81,11.2 44.81,10.64
  Bottom 0.203: v35.61,8.03 37.36,9.78 38.05,9.78 38.31,10.03 38.38,10.03 38.56,10.21 38.56,10.59 39.37,11.4 44.6,11.4 v44.81,11.2
VCC2_5V
  Top 0.203: U1.24 43.14,7.08 C16.1 42.84,6.62 44.26,5.19 C15.1 46.82,5.19 U3.5
VCC3.3V  (via drill 0.25, 0.35)  (1 unrouted)
  Top 0.152: U1.1 v36.95,15.15 v36.96,15.16 | 43.12,12.94 43.24,13.06 U1.33 | C35.1 7.38,13.56 6.69,13.56 6.17,13.04 6.17,12.66 | 6.17,12.66 6.55,12.28 6.55,11.33 6.76,11.12 v7.59,11.12 U$2.6 | 6.17,12.66 v6.17,11.95 v6.18,11.94 | C25.1 12.1,9.83 7.72,9.83 v7.59,9.7
  Top 0.203: C8.1 41.49,6.62 42.14,7.26 U1.22 42.14,8.89 42.4,9.15 42.82,9.15 43.12,9.45 43.12,12.94 | U1.33 44.45,13.06 44.57,13.18 44.57,13.69 44.72,13.84 44.81,13.84 C9.1 44.93,14.61 44.22,15.32 44.22,15.98 44.43,16.18 U8.3 45.62,16.18 45.7,16.26 45.7,17.02 45.97,17.3 45.97,17.34 46.12,17.49 46.2,17.49 | C7.1 36.09,14.48 36.18,14.56 U1.1 | U5.8 15.14,10.16 v15.09,10.11 15.01,10.11 | U5.12 14.94,6.96 C27.1 | C30.1 19.95,5.63 19.45,5.13 18.55,5.13 C24.1 18.03,4.9 17.28,4.15 15.97,4.15 15.82,4.3 15.82,5.6 | U5.24 22.79,6.19 22.69,6.1 | C31.1 23.63,5 C33.1 23.63,6.14 | U5.3 15.43,12.67 15.27,12.51 14.8,12.51 v14.63,12.34 | C26.1 18.32,14.86 U5.46 | C28.1 23.8,18.86 v23.8,19 | v21.95,15.85 21.82,15.72 21.82,15.46 21.79,15.44 U5.39 U5.40 | C32.1 25.5,7.63 | v17.35,17.14 17.39,17.14 | 35.39,18.09 C11.1 35.5,17.98 | U8.8 U8.7 | 46.2,17.49 46.54,17.49 46.84,17.18 U8.8 | R5.2 46.2,18.08 46.2,17.49 | U8.8 47.73,17.13 C17.1 | R12.2 41.78,18.8 v41.55,18.57
  Top 0.254: 15.01,10.11 14.66,9.75 C34.1 13.84,9.34 13.37,8.87 C25.1 13.37,7.98 13.96,7.39 13.96,6.66 14.13,6.49 C27.1 15.82,5.6
  Top 0.305: C30.1 20.22,5.53 22.12,5.53 C29.1 22.69,6.1 C33.1 | C32.1 23.63,6.14 | v24.69,15.01 24.91,14.79 R7.2 25.69,14.79 | 17.39,17.14 C26.1 | U4.5 35.39,18.09 | 35.5,17.98 36.01,17.48 v36.35,17.48
  Top 0.406: C7.1 35.51,15.05 v35.51,15.14 | v34.58,17.14 34.65,17.22 35.41,17.98 35.5,17.98
  Bottom 0.152: v36.96,15.16 38.04,14.07 42.6,14.07 43.61,13.06 v44.42,13.06 | 6.8,7.77 6.5,8.07 6.45,8.07 6.18,8.34 v6.18,11.94 | v7.59,9.7 v7.59,11.12
  Bottom 0.203: J2.2 8.97,5.6 6.8,7.77 | 22.35,17.55 21.97,17.55 21.95,17.53 | v36.35,17.48 36.73,17.86 40.84,17.86 v41.55,18.57
  Bottom 0.254: v15.09,10.11 15.09,11.89 v14.63,12.34 16.2,13.92 16.2,16 v17.35,17.14
  Bottom 0.305: v23.8,19 22.35,17.55 | v24.69,15.01 22.78,15.01 v21.95,15.85 21.95,17.53 | v17.35,17.14 17.75,17.55 21.97,17.55
  Bottom 0.406: v34.58,17.14 34.58,16.07 v35.51,15.14 35.05,14.68 27.8,14.68 27.75,14.63 26.72,14.63 26.34,15.01 v24.69,15.01
VIN  (via drill 0.25)
  Top 0.203: U7.4 8.97,6.46 | J3.1 4.17,12.7
  Top 0.406: J3.1 5.08,12.73 | U7.4 8.34,6.54 8.27,6.46 C21.1 R9.1 4.61,6.46 v4.39,6.68 | v5.41,14.15 5.54,14.15 6.02,13.66
  Top 0.61: 5.08,12.73 6.02,13.66 6.48,14.12 6.48,17.91 7.34,18.77 15.22,18.77 U$1.2 17.38,18.36 18.54,17.21 20.64,17.21 U6.1
  Bottom 0.406: v4.39,6.68 4.39,13.13 v5.41,14.15
VUSB  (via drill 0.25)
  Top 0.203: 32.41,16.2 U4.3 | v32.64,17.22 32.77,17.22 | R1.1 5.18,19.43 v5.36,19.61 | 23.01,19.3 23.42,19.3 23.6,19.48 23.96,19.48 24.29,19.15 R11.2
  Top 0.305: C10.1 30.78,16.2 U4.3 32.45,16.2
  Top 0.406: U2.3 32.35,4.76 32.66,5.08 32.66,6.55 32.55,6.67 U2.1 31.88,7.21 v31.83,7.26 | C12.1 30.43,5.14 R2.1 | U3.1 48.91,5.15 48.08,5.97 48.08,6.78 48.35,7.05 U3.3 49.4,8.73 | U4.1 32.45,18.09 32.77,17.78 32.77,17.22 32.77,16.51 32.45,16.2 | 32.41,16.2 32.41,12.11 32.77,11.75 32.77,9.05 v33.19,8.64 | C10.1 29.73,16.5 v29.69,16.54 | U6.2 22.2,17.58 21.3,17.58 20.51,18.36 U$1.1 | C14.1 49.4,8.73 | v49.61,16 49.61,8.94 49.4,8.73
  Top 0.508: C12.1 30.67,5.19 31.1,4.76 U2.3
  Top 0.61: U6.2 22.99,16.79 22.99,17.92 23.01,17.95 23.01,19.3 23.01,19.7 21.59,21.12 J1.3
  Bottom 0.203: 33.19,8.62 v33.19,8.64 | v5.36,19.61 19.97,19.61 J1.3
  Bottom 0.406: v31.83,7.26 33.19,8.62 | v32.64,17.22 32.64,18.21 34.06,19.63 44.63,19.63 46.46,17.8 48.77,17.8 49.61,16.97 v49.61,16 | v29.69,16.54 26.29,19.93 23.59,19.93 22.3,21.23 J1.3

### Text on the board
tPlace: RST
tNames: BAT | NC | USB | 48 | 47 | 46 | 45 | 44 | 43 | 42 | 38 | 37 | 6 | 9 | 11 | RST | +3V3 | 4 | GND | 10 | 12 | 13 | 18 | 19 | 20 | 21 | 23 | 25
bNames: IcyBlue Feather / ICE5LP4K Development Board / Designed By Seth Kerr (2022)